# Altium schematic sheet io.schdoc
size Letter
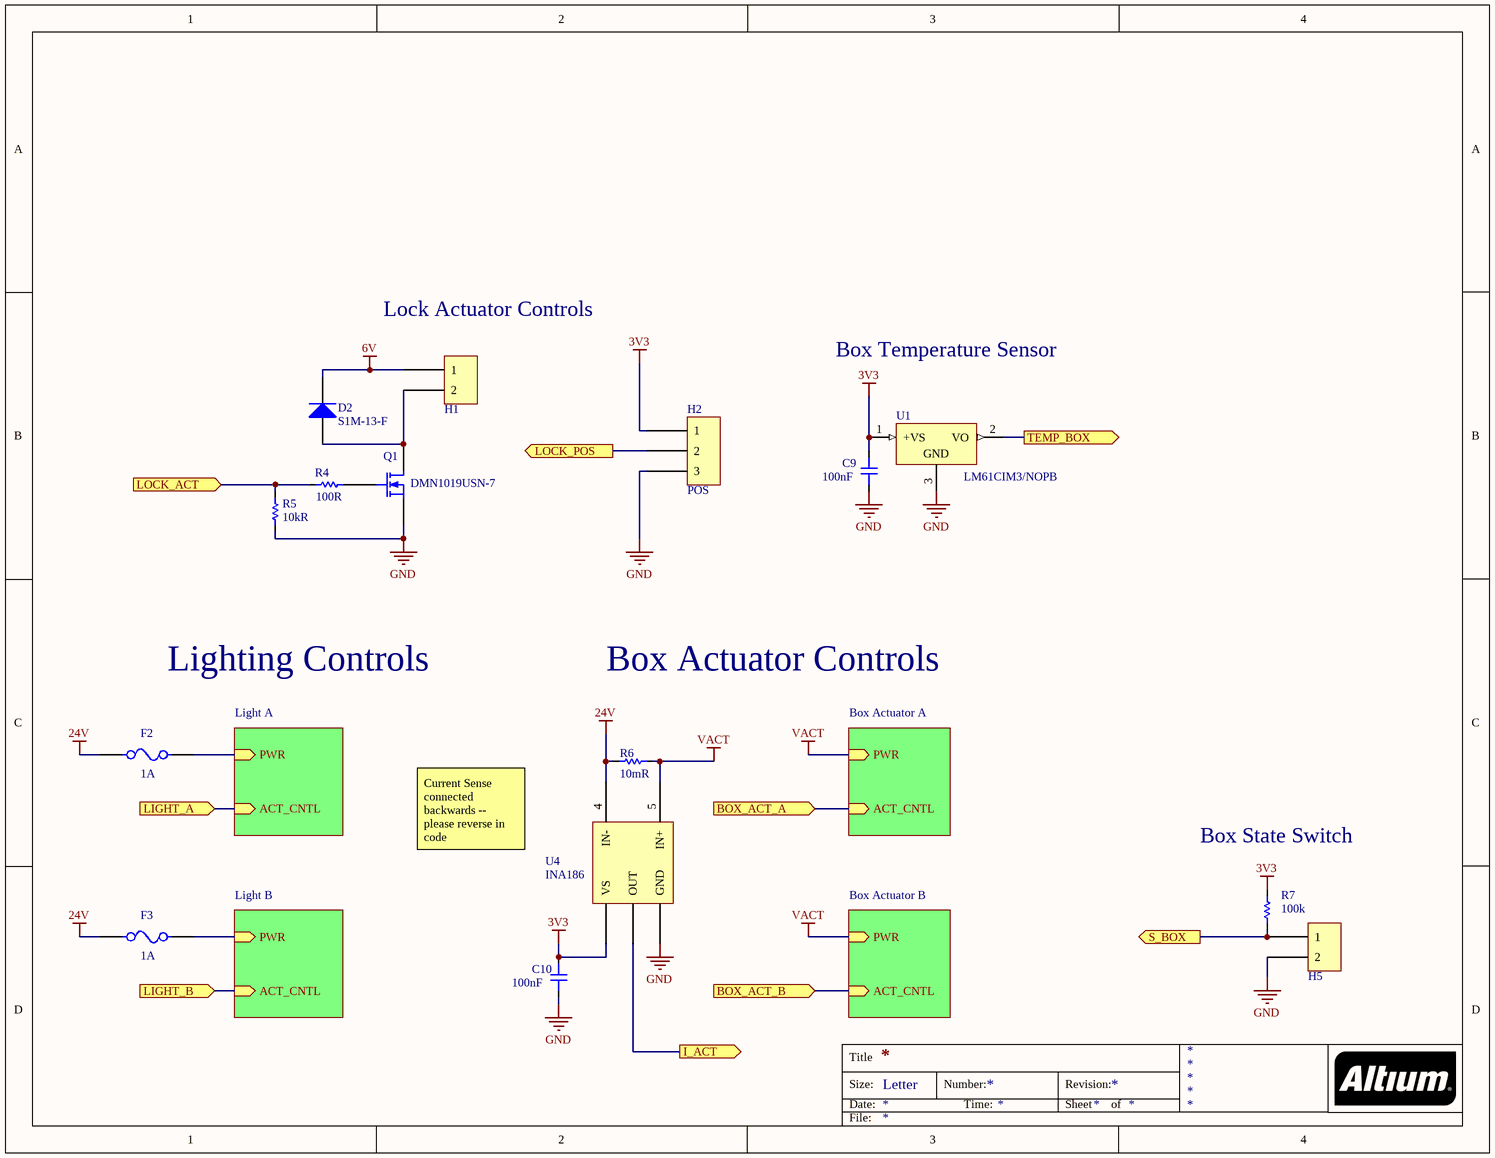
[diagram p0: io.schdoc]

## Parts
C9  Capacitance: 100nF  [CAP 0805 L]  (hidden comment: value)
C10  Capacitance: 100nF  [CAP 0805 L]  (hidden comment: value)
D2  S1M-13-F  [SMA]
F2  Current Rating: 1A  [Littelfuse_0154_0]  (hidden comment: 0154001.DRT)
F3  Current Rating: 1A  [Littelfuse_0154_0]  (hidden comment: 0154001.DRT)
H1  MOLEX_43650_2  [MOLEX_43650_2]  (value not drawn)
H2  POS  [MOLEX_43650_3]
H5  MOLEX_43650_2  [MOLEX_43650_2]  (value not drawn)
Q1  Manufacturer Part Number: DMN1019USN-7  [SOT23-3]  (hidden comment: MOSFET-N)
R4  Resistance: 100R  [RES 0603 L]  (hidden comment: value)
R5  Resistance: 10kR  [RES 0603 L]  (hidden comment: value)
R6  10mR  [CAP 0805 L]
R7  Resistance: 100k  [RES 0603 L]  (hidden comment: value)
U1  LM61CIM3/NOPB  [DBZ0003A_L]
U4  INA186  [SOT23-5]

## Sub-sheets
Box Actuator A = actuator.SchDoc: PWR (in), ACT_CNTL (in)
Box Actuator B = actuator.SchDoc: PWR (in), ACT_CNTL (in)
Light A = actuator.SchDoc: PWR (in), ACT_CNTL (in)
Light B = actuator.SchDoc: PWR (in), ACT_CNTL (in)

## Ports
BOX_ACT_A (in), BOX_ACT_B (in), I_ACT (out), LIGHT_A (in), LIGHT_B (in), LOCK_ACT (in), LOCK_POS (out), S_BOX (out), TEMP_BOX (out)

## Nets
3V3: C9.2 C10.2 H2.1 R7.2 U1.1(+VS) U4.3(VS)
6V: D2.2(K) H1.1
24V: F2.1 F3.1 R6.2 U4.4(IN-)
GND: C9.1 C10.1 H2.3 H5.2 Q1.3(S) R5.1 U1.3(GND) U4.1(GND)
VACT: R6.1 U4.5(IN+) ; sheet Box Actuator A/PWR, sheet Box Actuator B/PWR
BOX_ACT_A: port BOX_ACT_A, sheet Box Actuator A/ACT_CNTL
BOX_ACT_B: port BOX_ACT_B, sheet Box Actuator B/ACT_CNTL
I_ACT: U4.2(OUT) ; port I_ACT
LIGHT_A: port LIGHT_A, sheet Light A/ACT_CNTL
LIGHT_B: port LIGHT_B, sheet Light B/ACT_CNTL
LOCK_ACT: R4.2 R5.2 ; port LOCK_ACT
LOCK_POS: H2.2 ; port LOCK_POS
S_BOX: H5.1 R7.1 ; port S_BOX
TEMP_BOX: U1.2(VO) ; port TEMP_BOX
NetD2_1: D2.1(A) H1.2 Q1.1(D)
NetF2_2: F2.2 ; sheet Light A/PWR
NetF3_2: F3.2 ; sheet Light B/PWR
NetQ1_2: Q1.2(G) R4.1

## Notes on the sheet
- (near H1) Lock Actuator Controls
- Box Temperature Sensor
- Lighting Controls
- Box Actuator Controls
- Current Sense connected backwards -- please reverse in code
- (near R7) Box State Switch
- Title
- Size:
- Date:
- Letter
- Number:
- Time:
- Revision:
- Sheet
- of
- File:

## Library data of the parts
C9 C10 = CAP 0805: SMD Multilayer Ceramic Capacitor, AEC-Q200 C Series, 0.1 F, 10%, X7R, 25 V, 0805 [2012 Metric] ;RoHS Compliant: Yes; Manufacturer: KEMET; Manufacturer Part Number: C0805C104K3RACAUTO; Voltage Rating: 25V; Supplier 1: Digi-Key; Supplier Part Number 1: 399-6927-1-ND; Category: Ceramic Capacitors; Pricing 1: 1=0.18000, 10=0.12000, 50=0.07220, 100=0.06100, 500=0.04174, 1000=0.03693 (USD); Mount: Surface Mount; Case/Package: 0805; Case Code (Metric): 2012; Case Code (Imperial): 0805; Dielectric Material: Ceramic; Min Operating Temperature: -55°C; Max Operating Temperature: 125°C; Tolerance: 10%; Dielectric: X7R; Packaging: Tape and Reel; Package Quantity: 1; Voltage Rating (DC): 25V; Length: 2mm; Height: 0.9mm; Depth: 1.25mm; Width: 0.049inch; Thickness: 0.035inch; Ratings: AEC-Q200; Radiation Hardening: No; REACH SVHC: No SVHC; ComponentLink1URL: http://components.arrow.com/part/dataview/43510470S8189391N7429?src-supplier=Arrow; ComponentLink1Description: http://components.arrow.com/part/dataview/43510470S8189391N7429?src-supplier=Arrow; ComponentLink2URL: http://components.arrow.com/part/dataview/0323_00324902?src-supplier=Arrow+Europe; ComponentLink2Description: http://components.arrow.com/part/dataview/0323_00324902?src-supplier=Arrow+Europe; ComponentLink3URL: http://www.farnell.com/datasheets/2314205.pdf?src-supplier=Farnell; ComponentLink3Description: http://www.farnell.com/datasheets/2314205.pdf?src-supplier=Farnell; ComponentLink4URL: http://www.farnell.com/datasheets/2120825.pdf?src-supplier=Farnell; ComponentLink4Description: http://www.farnell.com/datasheets/2120825.pdf?src-supplier=Farnell; ComponentLink5URL: https://www.verical.com/server-webapp/html/getDatasheet?partID=469266&src-supplier=Verical; ComponentLink5Description: https://www.verical.com/server-webapp/html/getDatasheet?partID=469266&src-supplier=Verical; ComponentLink6URL: http://capacitoredge.kemet.com/capedge2/DataSheet?pn=C0805C104K3RACAUTO&src-supplier=Avnet+Europe; ComponentLink6Description: http://capacitoredge.kemet.com/capedge2/DataSheet?pn=C0805C104K3RACAUTO&src-supplier=Avnet+Europe; ComponentLink7URL: http://www.farnell.com/datasheets/2120825.pdf?src-supplier=Element14; ComponentLink7Description: http://www.farnell.com/datasheets/2120825.pdf?src-supplier=Element14; ComponentLink8URL: https://search.kemet.com/component-edge/download/datasheet/C0805C104K3RACAUTO.pdf?src-supplier=Digi-Key; ComponentLink8Description: https://search.kemet.com/component-edge/download/datasheet/C0805C104K3RACAUTO.pdf?src-supplier=Digi-Key; ComponentLink9URL: https://api.kemet.com/component-edge/download/datasheet/C0805C104K3RACAUTO.pdf?src-supplier=Digi-Key; ComponentLink9Description: https://api.kemet.com/component-edge/download/datasheet/C0805C104K3RACAUTO.pdf?src-supplier=Digi-Key
D2 = Diode: Default Diode
F2 F3 = 0154005.DRT: LITTELFUSE - 0154001.DRT - FUSE, SMD, 1A, OMNI BLOCK, TIME DELAY; Color: White; Body Material: Thermoplastic; DC Cold Resistance: 225mR; Power Dissipation: 125W; Fuse Type: Board Mount (Cartridge Style Excluded); Voltage Rating (AC): 125V; Approvals: UL,PSE; Supplier 1: Digi-Key; Supplier Part Number 1: F1303TR-ND; Manufacturer: Littelfuse; Manufacturer Part Number: 0154001.DRT; Category: Fuses; Pricing 1: 1500=1.31037, 3000=1.23890, 7500=1.19125 (USD); Mount: Surface Mount,Holder; Case/Package: SMD/SMT; Number of Pins: 2; Terminal Material: Copper; Min Operating Temperature: -55°C; Max Operating Temperature: 125°C; Voltage Rating (DC): 125V; Packaging: Tape and Reel; Package Quantity: 1500; Fuse Current: 1A; Working Voltage: 125V; Voltage Rating: 125V; Length: 9.73mm; Height: 3.81mm; Depth: 5.03mm; Width: 5.03mm; Radiation Hardening: No; Lead Free: Lead Free; REACH SVHC: Unknown; Flammability Rating: UL94 V-0; ComponentLink1URL: https://datasheet.ciiva.com/1268/1840330-1268625.pdf?src-supplier=Element14; ComponentLink1Description: https://datasheet.ciiva.com/1268/1840330-1268625.pdf?src-supplier=Element14; ComponentLink2URL: https://datasheet.ciiva.com/4485/littelfuse-fuseblocks-154-155-4485399.pdf?src-supplier=Mouser; ComponentLink2Description: https://datasheet.ciiva.com/4485/littelfuse-fuseblocks-154-155-4485399.pdf?src-supplier=Mouser; ComponentLink3URL: https://datasheet.ciiva.com/14102/aa154xxx-data-e-14102970.pdf?src-supplier=Distrelec; ComponentLink3Description: https://datasheet.ciiva.com/14102/aa154xxx-data-e-14102970.pdf?src-supplier=Distrelec; ComponentLink4URL: https://datasheet.ciiva.com/46406/1840330-46406107.pdf?src-supplier=Element14; ComponentLink4Description: https://datasheet.ciiva.com/46406/1840330-46406107.pdf?src-supplier=Element14; ComponentLink5URL: https://datasheet.ciiva.com/46406/1788337-46406172.pdf?src-supplier=Element14; ComponentLink5Description: https://datasheet.ciiva.com/46406/1788337-46406172.pdf?src-supplier=Element14; ComponentLink6URL: https://datasheet.ciiva.com/22712/1840330-22712958.pdf?src-supplier=Element14; ComponentLink6Description: https://datasheet.ciiva.com/22712/1840330-22712958.pdf?src-supplier=Element14
H1 H5 = MOLEX_43650_2: MOLEX - 43650-0227 - Wire-To-Board Connector, 3 mm, 2 Contacts, Header, Micro-Fit 3.0 43650 Series, Through Hole, 1 Rows; Connector Type: Header,Male Pin; Number of Positions: 2; Number of Ports: 1; Pitch: 3mm; Supplier 1: Digi-Key; Supplier Part Number 1: WM10656-ND; Manufacturer: Molex; Manufacturer Part Number: 43650-0227; Category: Connectors; Pricing 1: 1=0.80000, 10=0.74800, 100=0.57340, 500=0.49860, 1000=0.41135, 5000=0.36149, 10000=0.33656 (USD); Mount: Through Hole; Contact Plating: Tin,Bright; Color: Black; Contact Material: Brass; Housing Material: Thermoplastic; Number of Terminals: 2; Contact Shape: Square; Insulation Material: Polymer; Min Operating Temperature: -40°C; Max Operating Temperature: 105°C; Packaging: Tray; Package Quantity: 3264; Number of Rows: 1; Termination: Solder; Fastening Type: Ramp; Number of Contacts: 2; Orientation: Straight; Length: 9.65mm; Depth: 5.57mm; ComponentLink1URL: https://datasheet.ciiva.com/6840/436500227-sd-6840390.pdf?src-supplier=Digi-Key; ComponentLink1Description: https://datasheet.ciiva.com/6840/436500227-sd-6840390.pdf?src-supplier=Digi-Key; ComponentLink2URL: https://datasheet.ciiva.com/3944/28290436500227-pcb-headers-3944690.pdf?src-supplier=Arrow; ComponentLink2Description: https://datasheet.ciiva.com/3944/28290436500227-pcb-headers-3944690.pdf?src-supplier=Arrow; ComponentLink3URL: https://datasheet.ciiva.com/30077/0436500227-pcb-headers-30077244.pdf?src-supplier=Onlinecomponents.com; ComponentLink3Description: https://datasheet.ciiva.com/30077/0436500227-pcb-headers-30077244.pdf?src-supplier=Onlinecomponents.com; ComponentLink4URL: https://datasheet.ciiva.com/7920/1629867-7920765.pdf?src-supplier=Element14; ComponentLink4Description: https://datasheet.ciiva.com/7920/1629867-7920765.pdf?src-supplier=Element14
H2 = TERM_3P: Stepper position potentiometer
Q1 = MOSFET-N: MOSFET 12V N-Ch Enh FET 2426pF 27.3nC; Manufacturer: Diodes; Continuous Drain Current (ID): 9.3A; Rds On Max: 10mR; Input Capacitance: 2.426nF; Max Power Dissipation: 680mW; Capacitance: 2.426E-09F; Element Configuration: Single; Number of Channels: 1; Drain to Source Resistance: 41mR; Gate to Source Voltage (Vgs): 4.5V; Fall Time: 16.8ns; Rise Time: 57.6ns; Turn-Off Delay Time: 22.2ns; Turn-On Delay Time: 7.6ns; Supplier 1: Digi-Key; Supplier Part Number 1: DMN1019USN-7DICT-ND; Category: MOSFETs; Pricing 1: 1=0.43000, 10=0.34700, 25=0.31800, 100=0.19960, 250=0.19740, 500=0.18482, 1000=0.12568 (USD); Mount: Surface Mount; Case/Package: TO-236-3; Weight: 0.000282oz; Min Operating Temperature: -55°C; Max Operating Temperature: 150°C; Packaging: Tape and Reel; Drain to Source Voltage (Vdss): 12V; Drain to Source Breakdown Voltage: 12V; Package Quantity: 3000; Lead Free: Lead Free; ComponentLink1URL: http://www.farnell.com/datasheets/2814395.pdf?src-supplier=Farnell; ComponentLink1Description: http://www.farnell.com/datasheets/2814395.pdf?src-supplier=Farnell; ComponentLink2URL: http://www.mouser.com/ds/2/115/DMN1019USN-336718.pdf?src-supplier=Mouser; ComponentLink2Description: http://www.mouser.com/ds/2/115/DMN1019USN-336718.pdf?src-supplier=Mouser; ComponentLink3URL: https://www.diodes.com/assets/Datasheets/DMN1019USN.pdf?src-supplier=Digi-Key; ComponentLink3Description: https://www.diodes.com/assets/Datasheets/DMN1019USN.pdf?src-supplier=Digi-Key; ComponentLink4URL: http://www.farnell.com/datasheets/2814395.pdf?src-supplier=Newark; ComponentLink4Description: http://www.farnell.com/datasheets/2814395.pdf?src-supplier=Newark
R4 = RES 0603: CRGCQ 0603 100R 5%; Manufacturer: TE Connectivity; Manufacturer Part Number: CRGCQ0603J100R; Max Power Dissipation: 100mW; Temperature Coefficient: 100ppm/°C; Supplier 1: Digi-Key; Supplier Part Number 1: A130085CT-ND; Category: Chip SMD Resistors; Pricing 1: 1=0.10000, 10=0.02100, 100=0.00860, 1000=0.00387, 2500=0.00336 (USD); Case/Package: 0603; Case Code (Imperial): 0603; Case Code (Metric): 1608; Min Operating Temperature: -55°C; Max Operating Temperature: 155°C; Composition: Thick Film; Features: Moisture Resistant,Automotive AEC-Q200; Packaging: Cut Tape; Tolerance: 5%; Number of Terminations: 2; ComponentLink1URL: https://www.te.com/commerce/DocumentDelivery/DDEController?Action=srchrtrv&amp;DocNm=1773204-3&amp;DocType=DS&amp;DocLang=English&src-supplier=Digi-Key; ComponentLink1Description: https://www.te.com/commerce/DocumentDelivery/DDEController?Action=srchrtrv&amp;DocNm=1773204-3&amp;DocType=DS&amp;DocLang=English&src-supplier=Digi-Key
R5 = RES 0603: TE CONNECTIVITY - CRGCQ0603J10K - RES, 10K, 5%, 0603, THICK FILM; Max Power Dissipation: 100mW; Temperature Coefficient: 100ppm/°C; Supplier 1: Digi-Key; Supplier Part Number 1: A130097CT-ND; Manufacturer: TE Connectivity; Manufacturer Part Number: CRGCQ0603J10K; Category: Chip SMD Resistors; Pricing 1: 1=0.10000, 10=0.02100, 100=0.00860, 1000=0.00387, 2500=0.00336 (USD); Case/Package: 0603; Case Code (Imperial): 0603; Case Code (Metric): 1608; Min Operating Temperature: -55°C; Max Operating Temperature: 155°C; Composition: Thick Film; Features: Moisture Resistant,Automotive AEC-Q200; Packaging: Tape and Reel; Tolerance: 5%; Number of Terminations: 2; ComponentLink1URL: https://4donline.ihs.com/images/VipMasterIC/IC/TYEL/TYEL-S-A0004929575/TYEL-S-A0004929575-1.pdf?hkey=52A5661711E402568146F3353EA87419&src-supplier=Farnell; ComponentLink1Description: https://4donline.ihs.com/images/VipMasterIC/IC/TYEL/TYEL-S-A0004929575/TYEL-S-A0004929575-1.pdf?hkey=52A5661711E402568146F3353EA87419&src-supplier=Farnell; ComponentLink2URL: https://4donline.ihs.com/images/VipMasterIC/IC/TYEL/TYEL-S-A0004929575/TYEL-S-A0004929575-1.pdf?hkey=52A5661711E402568146F3353EA87419&src-supplier=Newark; ComponentLink2Description: https://4donline.ihs.com/images/VipMasterIC/IC/TYEL/TYEL-S-A0004929575/TYEL-S-A0004929575-1.pdf?hkey=52A5661711E402568146F3353EA87419&src-supplier=Newark; ComponentLink3URL: https://www.te.com/commerce/DocumentDelivery/DDEController?Action=srchrtrv&amp;DocNm=1773204-3&amp;DocType=DS&amp;DocLang=English&src-supplier=Digi-Key; ComponentLink3Description: https://www.te.com/commerce/DocumentDelivery/DDEController?Action=srchrtrv&amp;DocNm=1773204-3&amp;DocType=DS&amp;DocLang=English&src-supplier=Digi-Key; ComponentLink4URL: http://www.te.com/commerce/DocumentDelivery/DDEController?Action=srchrtrv&DocNm=1773204-3&DocType=DS&DocLang=English&src-supplier=Digi-Key; ComponentLink4Description: http://www.te.com/commerce/DocumentDelivery/DDEController?Action=srchrtrv&DocNm=1773204-3&DocType=DS&DocLang=English&src-supplier=Digi-Key
R6 = RES 0603: Resistor Thick Film 0.01Ohm 0.5% 0.5W 2-Pin 0805 T/R; Manufacturer: Panasonic; Manufacturer Part Number: ERJ-6CWDR010V; Supplier 1: Digi-Key; Supplier Part Number 1: P124401CT-ND; Pricing 1: 1=0.65000, 10=0.48100, 25=0.39000, 50=0.33920, 100=0.27990, 250=0.24312, 500=0.19790, 1000=0.15696 (USD)
R7 = RES 0603: CRGCQ 0603 100K 5%; Manufacturer: TE Connectivity; Manufacturer Part Number: CRGCQ0603J100K; Max Power Dissipation: 100mW; Temperature Coefficient: 100ppm/°C; Supplier 1: Digi-Key; Supplier Part Number 1: A130103CT-ND; Category: Chip SMD Resistors; Pricing 1: 1=0.10000, 10=0.02100, 100=0.00860, 1000=0.00387, 2500=0.00336 (USD); Case/Package: 0603; Case Code (Imperial): 0603; Case Code (Metric): 1608; Min Operating Temperature: -55°C; Max Operating Temperature: 155°C; Composition: Thick Film; Features: Moisture Resistant,Automotive AEC-Q200; Packaging: Tape and Reel; Tolerance: 5%; Number of Terminations: 2; ComponentLink1URL: https://www.te.com/commerce/DocumentDelivery/DDEController?Action=srchrtrv&amp;DocNm=1773204-3&amp;DocType=DS&amp;DocLang=English&src-supplier=Digi-Key; ComponentLink1Description: https://www.te.com/commerce/DocumentDelivery/DDEController?Action=srchrtrv&amp;DocNm=1773204-3&amp;DocType=DS&amp;DocLang=English&src-supplier=Digi-Key; ComponentLink2URL: https://4donline.ihs.com/images/VipMasterIC/IC/TYEL/TYEL-S-A0004929575/TYEL-S-A0004929575-1.pdf?hkey=52A5661711E402568146F3353EA87419&src-supplier=Farnell; ComponentLink2Description: https://4donline.ihs.com/images/VipMasterIC/IC/TYEL/TYEL-S-A0004929575/TYEL-S-A0004929575-1.pdf?hkey=52A5661711E402568146F3353EA87419&src-supplier=Farnell; ComponentLink3URL: https://4donline.ihs.com/images/VipMasterIC/IC/TYEL/TYEL-S-A0004929575/TYEL-S-A0004929575-1.pdf?hkey=52A5661711E402568146F3353EA87419&src-supplier=Newark; ComponentLink3Description: https://4donline.ihs.com/images/VipMasterIC/IC/TYEL/TYEL-S-A0004929575/TYEL-S-A0004929575-1.pdf?hkey=52A5661711E402568146F3353EA87419&src-supplier=Newark; ComponentLink4URL: https://4donline.ihs.com/images/VipMasterIC/IC/TYEL/TYEL-S-A0004929575/TYEL-S-A0004929575-1.pdf?hkey=52A5661711E402568146F3353EA87419&src-supplier=Element14; ComponentLink4Description: https://4donline.ihs.com/images/VipMasterIC/IC/TYEL/TYEL-S-A0004929575/TYEL-S-A0004929575-1.pdf?hkey=52A5661711E402568146F3353EA87419&src-supplier=Element14
U1 = CMP-0066-00260-3: 2.7V Temperature Sensor, 3-pin SOT-23, Pb-Free; Manufacturer: Texas Instruments; PowerWise: N; PackageTopMarking: T1C*XTT; CompType: Temp Sensor IC; PackageReference: DBZ0003A; ComponentLink1URL: http://www.ti.com/general/docs/lit/getliterature.tsp?genericPartNumber=LM61&fileType=pdf; PinCount: 3; PackageDescription: Molded SOT-23, .115 x .051 x .037in Body, 3 Lead, .075 in Pitch; ComponentLink1Description: Datasheet URL; RoHS: Y